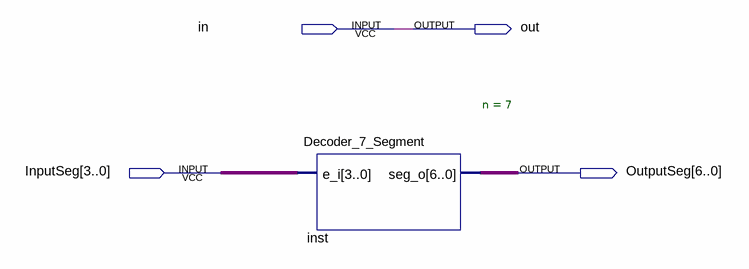
[diagram p0: schematic sheet]
// Quartus schematic Lab1_FPGA.bdf as structural Verilog: 1 symbols, 4 pins
module Lab1_FPGA (
  input  in,
  input  [3:0] InputSeg,
  output out,
  output [6:0] OutputSeg
);

  Decoder_7_Segment #(.n(7)) inst (.e_i(InputSeg), .seg_o(OutputSeg));

  assign out = in;
endmodule
